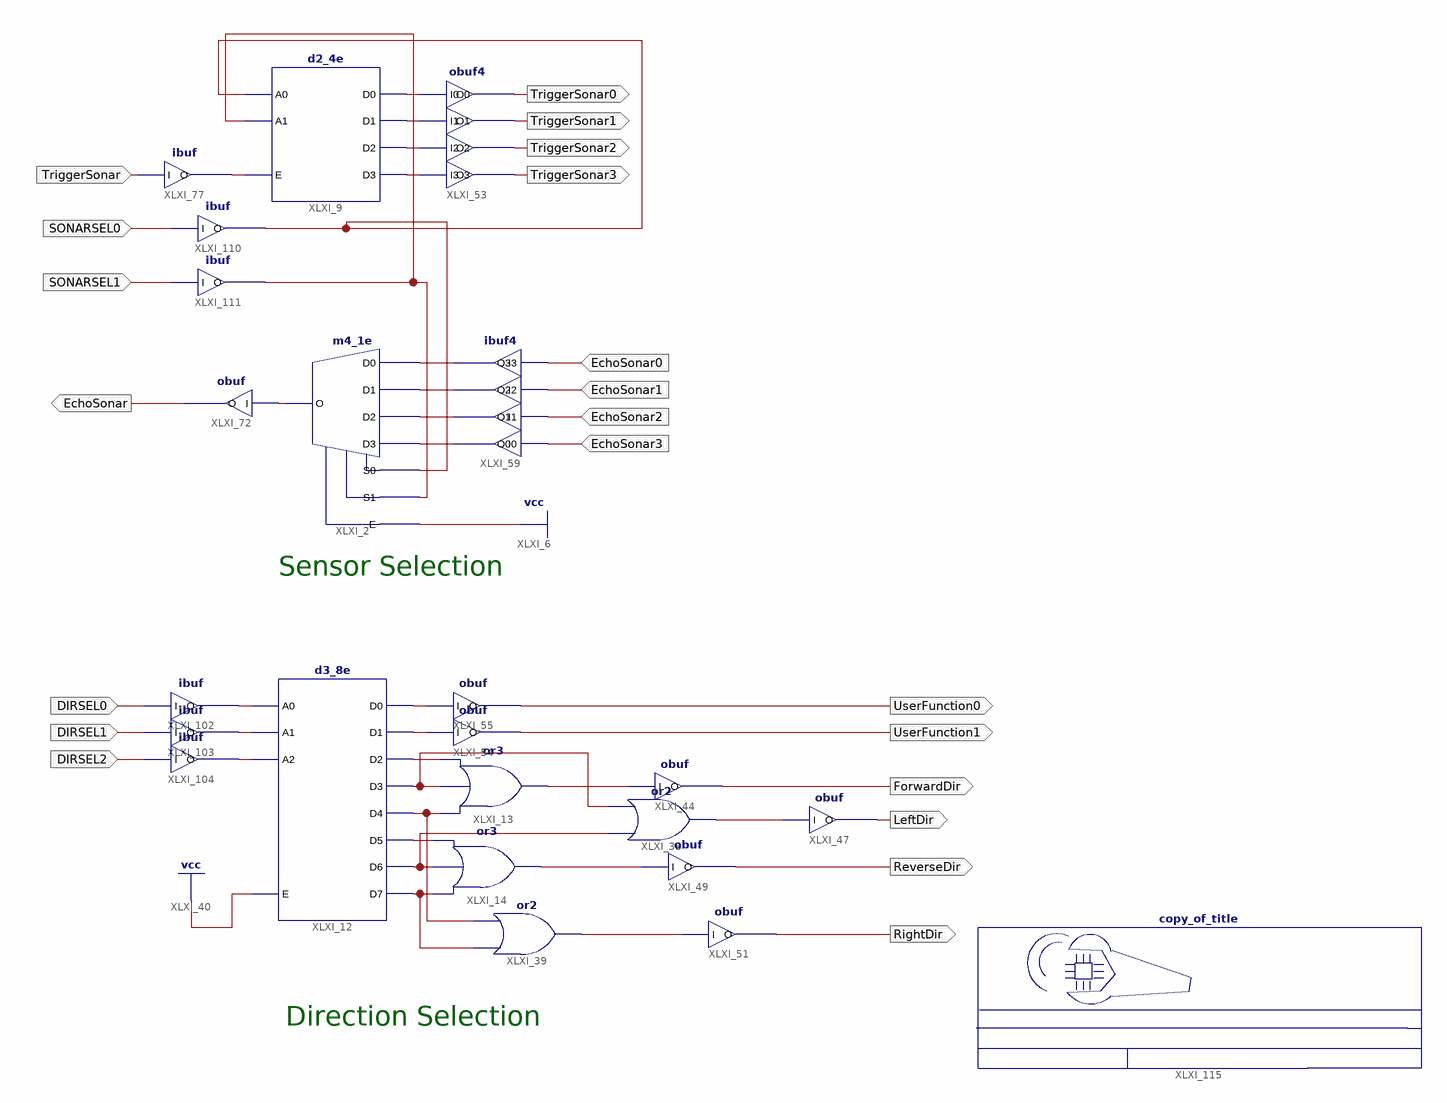
[diagram p0: schematic sheet 1]
// Xilinx ISE schematic ART.sch (xc9500) as structural Verilog: 23 symbols, 21 ports
module ART (
  input  DIRSEL0,
  input  DIRSEL1,
  input  DIRSEL2,
  input  EchoSonar3,
  input  EchoSonar2,
  input  EchoSonar1,
  input  EchoSonar0,
  input  TriggerSonar,
  input  SONARSEL0,
  input  SONARSEL1,
  output ForwardDir,
  output ReverseDir,
  output RightDir,
  output LeftDir,
  output UserFunction0,
  output UserFunction1,
  output TriggerSonar2,
  output TriggerSonar3,
  output TriggerSonar1,
  output TriggerSonar0,
  output EchoSonar
);

  wire Left, Reverse, Right, XLXN_159, XLXN_164, XLXN_168, XLXN_169, XLXN_238, XLXN_239, XLXN_240, XLXN_241,
       XLXN_242, XLXN_250, XLXN_251, XLXN_254, XLXN_258, XLXN_259, XLXN_260, XLXN_261, XLXN_322, XLXN_340,
       XLXN_385, XLXN_386, XLXN_387, XLXN_396, XLXN_398, XLXN_401;

  or XLXI_13 (XLXN_254, XLXN_168, XLXN_238, XLXN_159);
  or XLXI_14 (Reverse, XLXN_169, XLXN_401, XLXN_164);
  or XLXI_39 (Right, XLXN_169, XLXN_168);
  or XLXI_38 (Left, XLXN_401, XLXN_238);
  obuf XLXI_49 (.I(Reverse), .O(ReverseDir));
  obuf XLXI_51 (.I(Right), .O(RightDir));
  obuf XLXI_44 (.I(XLXN_254), .O(ForwardDir));
  obuf XLXI_47 (.I(Left), .O(LeftDir));
  obuf XLXI_54 (.I(XLXN_250), .O(UserFunction1));
  obuf XLXI_55 (.I(XLXN_251), .O(UserFunction0));
  d3_8e XLXI_12 (
    .A0(XLXN_385), .A1(XLXN_386), .A2(XLXN_387), .E(1'b1), .D0(XLXN_251), .D1(XLXN_250), .D2(XLXN_159),
    .D3(XLXN_238), .D4(XLXN_168), .D5(XLXN_164), .D6(XLXN_401), .D7(XLXN_169));
  ibuf XLXI_102 (.I(DIRSEL0), .O(XLXN_385));
  ibuf XLXI_103 (.I(DIRSEL1), .O(XLXN_386));
  ibuf XLXI_104 (.I(DIRSEL2), .O(XLXN_387));
  copy_of_title XLXI_115 ();
  d2_4e XLXI_9 (.A0(XLXN_396), .A1(XLXN_398), .E(XLXN_340), .D0(XLXN_239), .D1(XLXN_240), .D2(XLXN_241), .D3(XLXN_242));
  obuf4 XLXI_53 (
    .I0(XLXN_239), .I1(XLXN_240), .I2(XLXN_241), .I3(XLXN_242), .O0(TriggerSonar0), .O1(TriggerSonar1),
    .O2(TriggerSonar2), .O3(TriggerSonar3));
  ibuf4 XLXI_59 (
    .I0(EchoSonar3), .I1(EchoSonar2), .I2(EchoSonar1), .I3(EchoSonar0), .O0(XLXN_261), .O1(XLXN_260),
    .O2(XLXN_259), .O3(XLXN_258));
  obuf XLXI_72 (.I(XLXN_322), .O(EchoSonar));
  m4_1e XLXI_2 (
    .D0(XLXN_258), .D1(XLXN_259), .D2(XLXN_260), .D3(XLXN_261), .E(1'b1), .S0(XLXN_396), .S1(XLXN_398),
    .O(XLXN_322));
  ibuf XLXI_77 (.I(TriggerSonar), .O(XLXN_340));
  ibuf XLXI_110 (.I(SONARSEL0), .O(XLXN_396));
  ibuf XLXI_111 (.I(SONARSEL1), .O(XLXN_398));

  // Notes on the sheet:
  //   Sensor Selection
  //   Direction Selection
endmodule
